# Altium project TTK8.PrjPcb
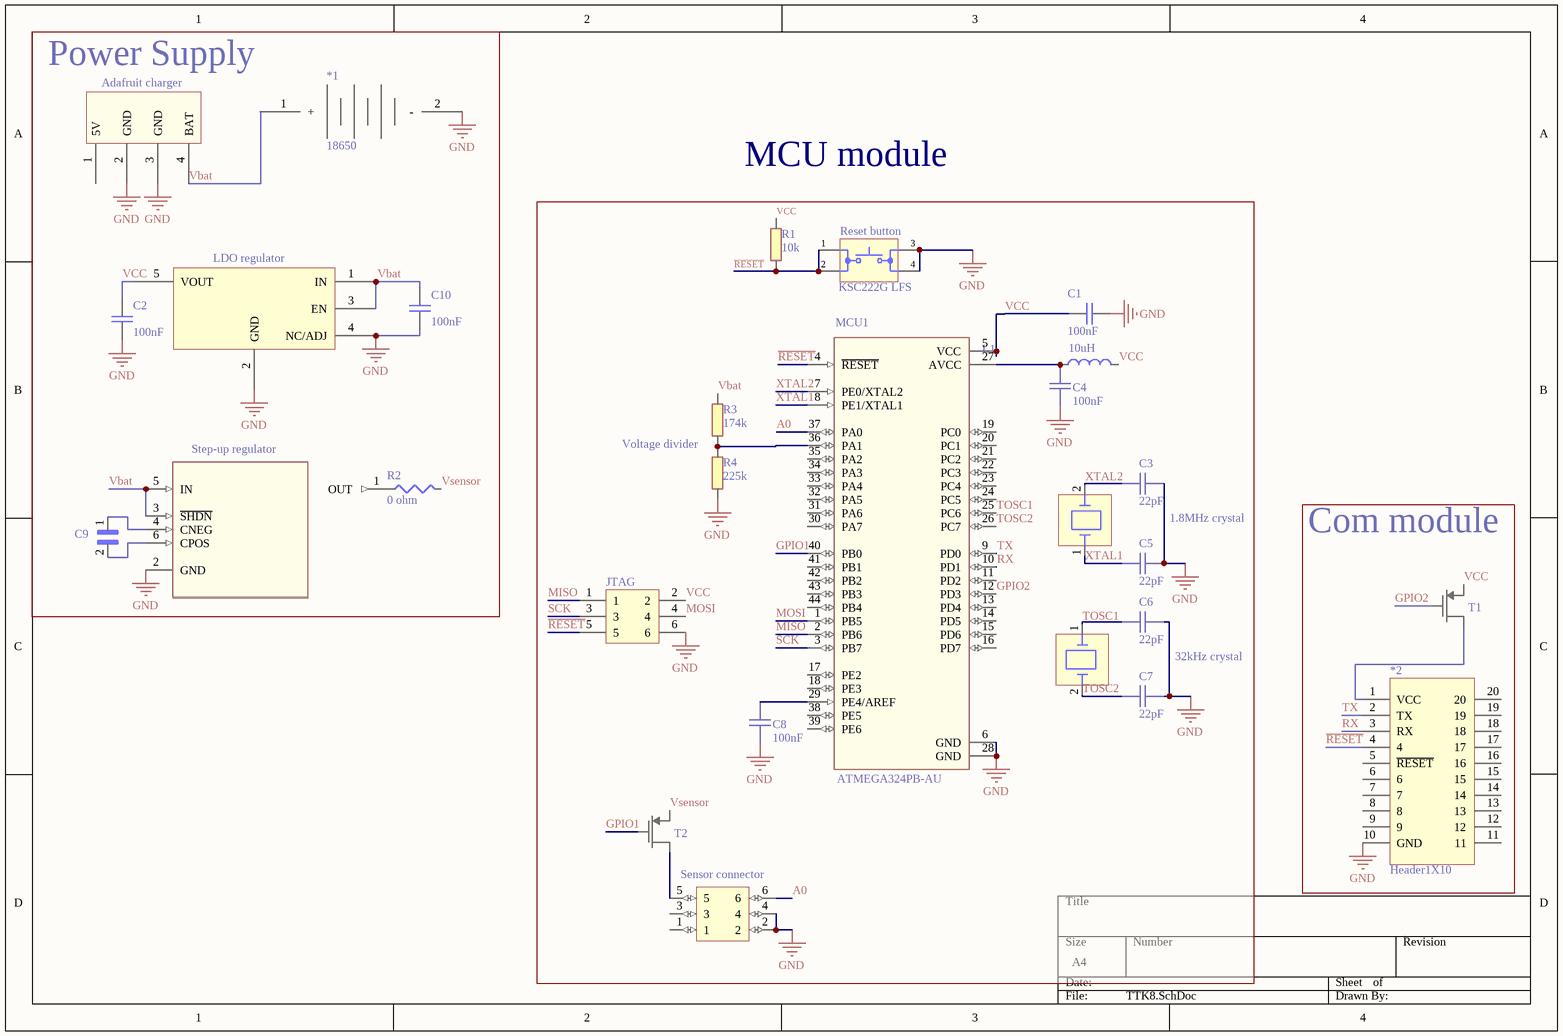
[diagram p0: TTK8.SchDoc]
1 sheet, 28 parts. Net scope: global (net labels, ports and power ports of the same name join across sheets).
Board file: TTK8.PcbDoc

## Sheet TTK8.SchDoc
size A4

### Parts
*1  18650  [18650]
*2  Header1X10  [Header1X10]
C1  value 100nF  [C0603]  (hidden comment: 02016D104KAT2A)
C2  value 100nF  [C0603]  (hidden comment: 02016D104KAT2A)
C3  22pF  [CAPC0805(2012)100_N]
C4  100nF  [CAPC0603(1608)55_N]
C5  22pF  [CAPC0805(2012)100_N]
C6  22pF  [CAPC0805(2012)100_N]
C7  22pF  [CAPC0805(2012)100_N]
C8  100nF  [CAPC0603(1608)55_N]
C9  C0603C105K8PACTU  [C0603C105K8PACTU]  (value not drawn)
C10  value 100nF  [C0603]  (hidden comment: 02016D104KAT2A)
J1  Header 2x3  [Header 2x3 2.54mm]  (value not drawn)
JTAG  123-34-2234_1  [Header 2x3 male]  (value not drawn)
L1  value 10uH  [Inductor 0603]  (hidden comment: MLZ1608A2R2WT)
MCU1  ATMEGA324PB-AU  [*QFP80P1200X1200X120-44N]
R1  10k  [RESC0603(1608)_N]
R2  value 0 ohm  [R0402]  (hidden comment: CRCW04020000Z0ED)
R3  174k  [RESC0603(1608)_N]
R4  225k  [RESC0603(1608)_N]
reg1  CAT3200TDI-GT3  [CAT3200TDI-GT3]  (value not drawn)
Reset1  KSC222G LFS  [KSC222G LFS]
T1  DMP1045U  [DMP1045U]  (value not drawn)
T2  DMP1045U  [DMP1045U]  (value not drawn)
U1  AdaUSBC  [AdaUSBC]  (value not drawn)
U2  NCP718ASN250T1G  [NCP718ASN250T1G]  (value not drawn)
Y1  AB-1.8432MHZ-B2  [AB-1.8432MHZ-B2]  (value not drawn)
Y2  9HT10-32.768KEZC-T  [9HT10-32.768KEZC-T]  (value not drawn)

### Blocks framed on the sheet
Power Supply: *1 C2 C9 C10 R2 reg1 U1 U2
Com module: *2 T1

### Nets
GND: *1.2(-) *2.10(GND) C1.1 C2.1 C3.2 C4.1 C5.2 C6.2 C7.2 C8.1 C10.1 J1.2 J1.4 JTAG.6 MCU1.6(GND) MCU1.28(GND) R4.1 reg1.2(GND) Reset1.3 Reset1.4 U1.2(GND) U1.3(GND) U2.2(GND) U2.4(NC/ADJ)
A0: J1.6 MCU1.37(PA0)
GPIO1: MCU1.40(PB0) T2.1(G)
GPIO2: MCU1.12(PD3) T1.1(G)
MISO: JTAG.1 MCU1.2(PB6)
MOSI: JTAG.4 MCU1.1(PB5)
~{RESET}: *2.4 JTAG.5 MCU1.4(~{RESET}) R1.1 Reset1.1 Reset1.2
RX: *2.3(RX) MCU1.10(PD1)
SCK: JTAG.3 MCU1.3(PB7)
TOSC1: C6.1 MCU1.25(PC6) Y2.1
TOSC2: C7.1 MCU1.26(PC7) Y2.2
TX: *2.2(TX) MCU1.9(PD0)
Vbat: *1.1(+) C10.2 R3.2 reg1.3(~{SHDN}) reg1.5(IN) U1.4(BAT) U2.1(IN) U2.3(EN)
VCC: C1.2 C2.2 JTAG.2 L1.2 MCU1.5(VCC) R1.2 T1.2(S) U2.5(VOUT)
Vsensor: R2.2 T2.2(S)
XTAL1: C5.1 MCU1.8(PE1/XTAL1) Y1.1
XTAL2: C3.1 MCU1.7(PE0/XTAL2) Y1.2
Net*2_1: *2.1(VCC) T1.3(D)
NetC4_2: C4.2 L1.1 MCU1.27(AVCC)
NetC8_2: C8.2 MCU1.29(PE4/AREF)
NetC9_1: C9.1 reg1.4(CNEG)
NetC9_2: C9.2 reg1.6(CPOS)
NetJ1_5: J1.5 T2.3(D)
NetMCU1_36: MCU1.36(PA1) R3.1 R4.2
NetR2_1: R2.1 reg1.1(OUT)

Not connected (* = marked no-connect by the designer): *2 5(~{RESET}) 6 7 8 9 11 12 13 14 15 16 17 18 19 20; J1 1 3; MCU1 11(PD2) 13(PD4) 14(PD5) 15(PD6) 16(PD7) 17(PE2) 18(PE3) 19(PC0) 20(PC1) 21(PC2) 22(PC3) 23(PC4) 24(PC5) 30(PA7) 31(PA6) 32(PA5) 33(PA4) 34(PA3) 35(PA2) 38(PE5) 39(PE6) 41(PB1) 42(PB2) 43(PB3) 44(PB4); U1 1(5V)

### Notes on the sheet
- (near U1) Adafruit charger
- MCU module
- (near Reset1) Reset button
- (near U2) LDO regulator
- (near reg1) Step-up regulator
- Voltage divider
- 1.8MHz crystal
- 32kHz crystal
- (near J1) Sensor connector

### Library data of the parts
C1 C2 C10 = 02016D104KAT2A: C0603
C3 C5-C7 = 3133: 50v,; id: 3133; rad: 21; rom: GM; lager_type: Baklager; dybde: 5; hylle: 0; antall: 1000; pakke_opprettet_av: 815; pris: 1; leverandor: Farnell; pakketype: 0805; komponenttype: 2; pakke_opprettet: 14.11.2014 20:52:01; symbol_opprettet_av: 815; symbol_opprettet: 14.11.2014 20:19:34; navn: 22pF
C4 C8 = 5152: X7R 50V 5%; id: 5152; rad: 21; rom: OV; lager_type: Baklager; dybde: 0; antall: 1000; pakke_opprettet_av: 815; leverandor_varenr: 1759122; pris: 1; nokkelord: Kondensator, Capacitor, CAP; produsent: Multikomp; leverandor: Farnell; pakketype: 0603; komponenttype: 2; hylle: 0; pakke_opprettet: 18.02.2015 14:18:13; symbol_opprettet_av: 815; symbol_opprettet: 14.11.2014 20:19:34; navn: 100nF
C9 = C0603C105K8PACTU: C0603; Value: 1uf
J1 = 67996-406HLF: Header  2x3 2.54mm male
JTAG = 123-34-2234_1: Header 2x3 male 2.54mm
L1 = MLZ1608A2R2WT: Inductor 0603
MCU1 = ATMEGA324PB-AU: Avr, 32kb Flash, 1kb Ee, 2kb Ram - 20mhz, Tqfp, Ind Temp, Green 5 v/ Tqfp _a_; MF: Microchip; Package: TQFP-44 Microchip; MP: ATMEGA324PB-AU; SnapEDA_Link: https://www.snapeda.com/parts/ATMEGA324PB-AU/Microchip/view-part/?ref=snap; Availability: Unavailable; Price: None; Value: *
R1 = 5264: 0.1W 1% Thick film resistor; id: 5264; rad: 1; rom: OV; lager_type: Baklager; dybde: 3; hylle: 6; antall: 1200; pakke_opprettet_av: 815; leverandor_varenr: 2447230; pris: 0; nokkelord: Resistor Motstand; produsent: Multikomp; leverandor: Farnell; pakketype: 0603; pakke_opprettet: 08.07.2014 21:15:30; symbol_opprettet_av: 815; symbol_opprettet: 08.07.2014 21:16:33; navn: 10k; komponenttype: 1
R2 = CRCW04020000Z0ED: R0402
R3 R4 = 5264: 0.1W 1% Thick film resistor; id: 5264; rad: 1; rom: OV; lager_type: Baklager; dybde: 3; hylle: 6; antall: 1200; pakke_opprettet_av: 815; leverandor_varenr: 2447230; navn: 10k; pris: 0; nokkelord: Resistor Motstand; produsent: Multikomp; leverandor: Farnell; pakketype: 0603; pakke_opprettet: 08.07.2014 21:15:30; symbol_opprettet_av: 815; symbol_opprettet: 08.07.2014 21:16:33; komponenttype: 1
reg1 = CAT3200TDI-GT3: Switch-mode step up reg
Reset1 = KSC222G LFS: Button SMD
T1 T2 = DMP1045U: PMOS 5.2A -550mV; Threshold voltage: -550mV; Cont. drain current: 5.2A; Supplier Part Number 1: 2061526; Supplier 1: Farnell
Y1 = AB-1.8432MHZ-B2: Crystal 1.8432MHz
Y2 = 9HT10-32.768KEZC-T: Crystal 32.768kHz, SMD, 3.2mm x 1.5mm, 9pF, 10 ppm